# Altium project ChassisController.PrjPcb
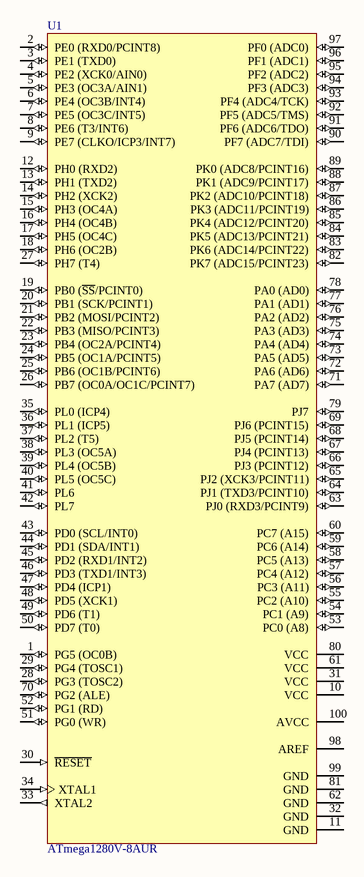
[diagram p0: MCU.SchDoc]
1 sheet, 1 parts. Net scope: global (net labels, ports and power ports of the same name join across sheets).
Board file: ChassisController.PcbDoc

## Sheet MCU.SchDoc
size A4

### Parts
U1  ATmega1280V-8AUR  [100A_M]

### Nets

Not connected (* = marked no-connect by the designer): U1 1(PG5_(OC0B)) 2(PE0_(RXD0/PCINT8)) 3(PE1_(TXD0)) 4(PE2_(XCK0/AIN0)) 5(PE3_(OC3A/AIN1)) 6(PE4_(OC3B/INT4)) 7(PE5_(OC3C/INT5)) 8(PE6_(T3/INT6)) 9(PE7_(CLKO/ICP3/INT7)) 10(VCC) 11(GND) 12(PH0_(RXD2)) 13(PH1_(TXD2)) 14(PH2_(XCK2)) 15(PH3_(OC4A)) 16(PH4_(OC4B)) 17(PH5_(OC4C)) 18(PH6_(OC2B)) 19(PB0_(~{SS}/PCINT0)) 20(PB1_(SCK/PCINT1)) 21(PB2_(MOSI/PCINT2)) 22(PB3_(MISO/PCINT3)) 23(PB4_(OC2A/PCINT4)) 24(PB5_(OC1A/PCINT5)) 25(PB6_(OC1B/PCINT6)) 26(PB7_(OC0A/OC1C/PCINT7)) 27(PH7_(T4)) 28(PG3_(TOSC2)) 29(PG4_(TOSC1)) 30(~{RESET}) 31(VCC) 32(GND) 33(XTAL2) 34(XTAL1) 35(PL0_(ICP4)) 36(PL1_(ICP5)) 37(PL2_(T5)) 38(PL3_(OC5A)) 39(PL4_(OC5B)) 40(PL5_(OC5C)) 41(PL6) 42(PL7) 43(PD0_(SCL/INT0)) 44(PD1_(SDA/INT1)) 45(PD2_(RXD1/INT2)) 46(PD3_(TXD1/INT3)) 47(PD4_(ICP1)) 48(PD5_(XCK1)) 49(PD6_(T1)) 50(PD7_(T0)) 51(PG0_(WR)) 52(PG1_(RD)) 53(PC0_(A8)) 54(PC1_(A9)) 55(PC2_(A10)) 56(PC3_(A11)) 57(PC4_(A12)) 58(PC5_(A13)) 59(PC6_(A14)) 60(PC7_(A15)) 61(VCC) 62(GND) 63(PJ0_(RXD3/PCINT9)) 64(PJ1_(TXD3/PCINT10)) 65(PJ2_(XCK3/PCINT11)) 66(PJ3_(PCINT12)) 67(PJ4_(PCINT13)) 68(PJ5_(PCINT14)) 69(PJ6_(PCINT15)) 70(PG2_(ALE)) 71(PA7_(AD7)) 72(PA6_(AD6)) 73(PA5_(AD5)) 74(PA4_(AD4)) 75(PA3_(AD3)) 76(PA2_(AD2)) 77(PA1_(AD1)) 78(PA0_(AD0)) 79(PJ7) 80(VCC) 81(GND) 82(PK7_(ADC15/PCINT23)) 83(PK6_(ADC14/PCINT22)) 84(PK5_(ADC13/PCINT21)) 85(PK4_(ADC12/PCINT20)) 86(PK3_(ADC11/PCINT19)) 87(PK2_(ADC10/PCINT18)) 88(PK1_(ADC9/PCINT17)) 89(PK0_(ADC8/PCINT16)) 90(PF7_(ADC7/TDI)) 91(PF6_(ADC6/TDO)) 92(PF5_(ADC5/TMS)) 93(PF4_(ADC4/TCK)) 94(PF3_(ADC3)) 95(PF2_(ADC2)) 96(PF1_(ADC1)) 97(PF0_(ADC0)) 98(AREF) 99(GND) 100(AVCC)

### Library data of the parts
U1 = CMP-0095-00520-1: 8-bit AVR Microcontroller, 1.8-5.5V, 4MHz, 128KB Flash, 4KB EEPROM, 8KB SRAM, 86 GPIO pins, 100-pin TQFP, Industrial Grade (-40°C to 85°C), Pb-Free, Reel; Code_JEDEC: MS-026-AED; ComponentLink2Description: ATmega640/1280/1281/2560/2561 Datasheet; ComponentLink3URL: http://www.atmel.com/dyn/resources/prod_documents/2549S.pdf; PackageVersion: revD, Oct-2010; PackageReference: 100A; ComponentLink1Description: Manufacturer URL; DatasheetVersion: revN, May-2011; PackageDescription: 100-Pin Thin Profile Plastic Quad Flat Pack (TQFP), 14 x 14 x 1.0 mm Body, 0.5 mm Pitch; ComponentLink1URL: http://www.atmel.com/; ComponentLink2URL: http://www.atmel.com/dyn/resources/prod_documents/doc2549.pdf; ComponentLink3Description: ATmega640/1280/1281/2560/2561 Summary